# Altium project SixAxIMU_VN.PrjPcb
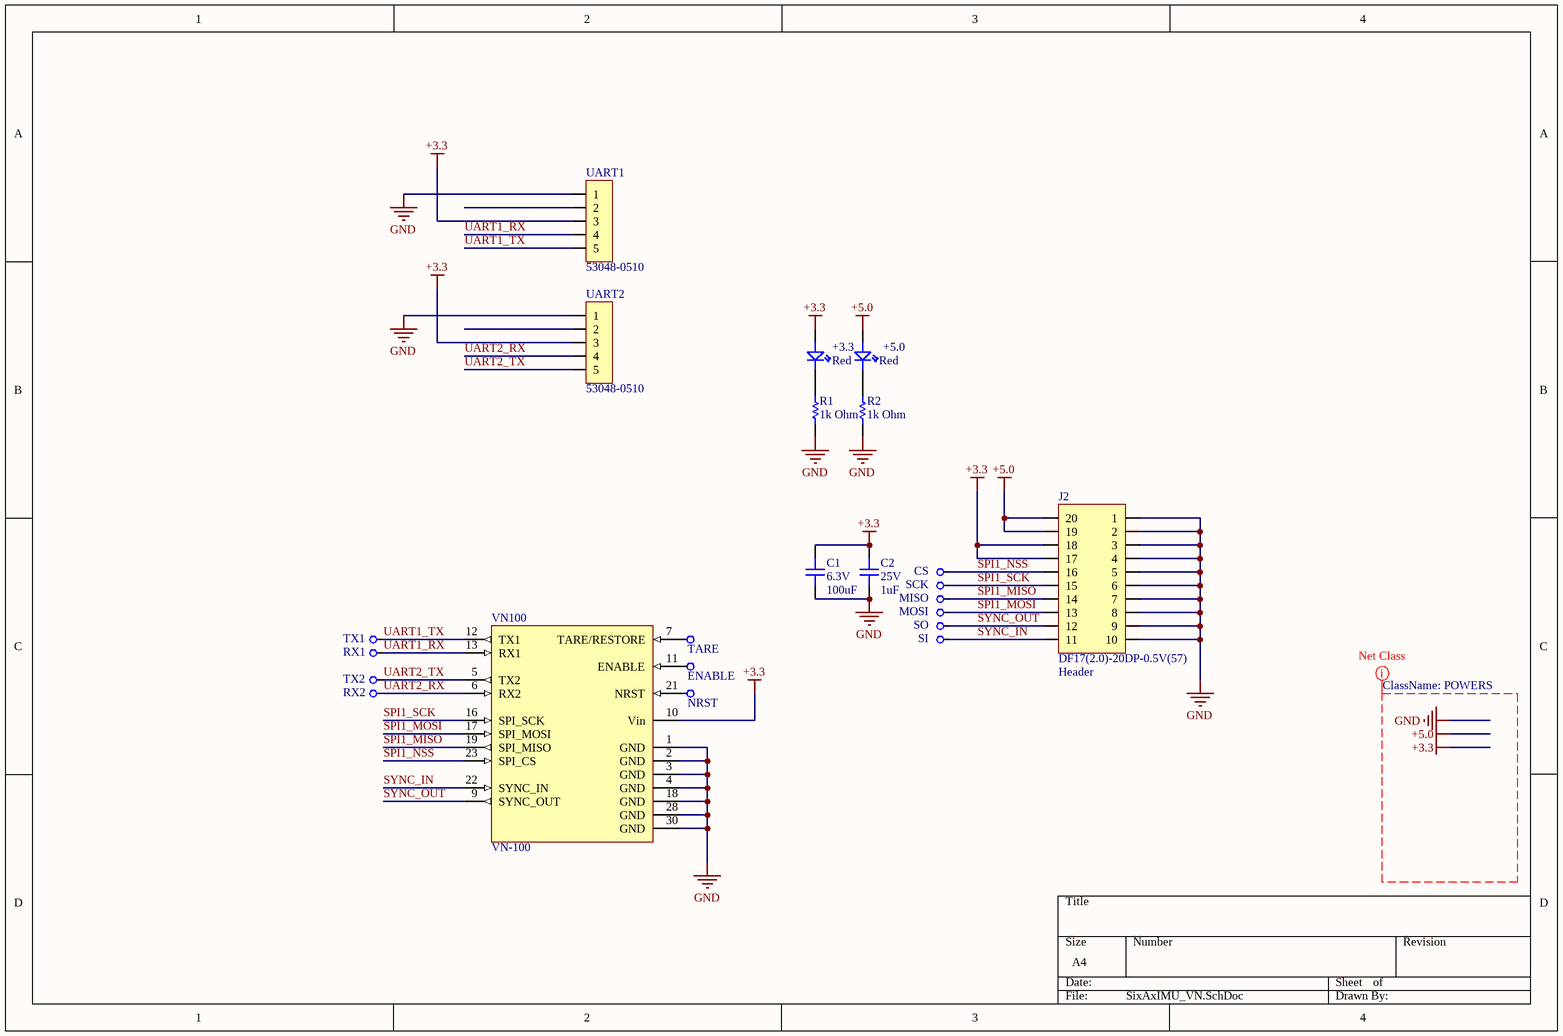
[diagram p0: SixAxIMU_VN.SchDoc]
1 sheet, 23 parts. Net scope: global (net labels, ports and power ports of the same name join across sheets).
Board file: SixAxIMU_VN.PcbDoc

## Sheet SixAxIMU_VN.SchDoc
size A4

### Parts
+3.3  Red  [LED 0603]
+5.0  Red  [LED 0603]
C1  value 100uF  Voltage Rating: 6.3V  [CAP 1206]  (hidden comment: CL31A107MQHNNNE)
C2  value 1uF  Voltage Rating: 25V  [CAP 0603]  (hidden comment: CL10A105KA8NNNC)
CS  TEST  [TEST_0.5mm, SMD]  (value not drawn)
ENABLE  TEST  [TEST_0.5mm, SMD]  (value not drawn)
J2  DF17(2.0)-20DP-0.5V(57)  Type: Header  [DF17(2.0)-20DP-0.5V(57)]
MISO  TEST  [TEST_0.5mm, SMD]  (value not drawn)
MOSI  TEST  [TEST_0.5mm, SMD]  (value not drawn)
NRST  TEST  [TEST_0.5mm, SMD]  (value not drawn)
R1  value 1k Ohm  [RES 0402]  (hidden comment: P311-1.00KLRTR-ND)
R2  value 1k Ohm  [RES 0402]  (hidden comment: P311-1.00KLRTR-ND)
RX1  TEST  [TEST_0.5mm, SMD]  (value not drawn)
RX2  TEST  [TEST_0.5mm, SMD]  (value not drawn)
SCK  TEST  [TEST_0.5mm, SMD]  (value not drawn)
SI  TEST  [TEST_0.5mm, SMD]  (value not drawn)
SO  TEST  [TEST_0.5mm, SMD]  (value not drawn)
TARE  TEST  [TEST_0.5mm, SMD]  (value not drawn)
TX1  TEST  [TEST_0.5mm, SMD]  (value not drawn)
TX2  TEST  [TEST_0.5mm, SMD]  (value not drawn)
UART1  53048-0510  [PicoBlade, 53048-0510]
UART2  53048-0510  [PicoBlade, 53048-0510]
VN100  VN-100  [VN-100]

### Nets
+3.3: +3.3.A C1.2 C2.2 J2.17 J2.18 UART1.3 UART2.3 VN100.10(Vin)
+5.0: +5.0.A J2.19 J2.20
GND: C1.1 C2.1 J2.1 J2.2 J2.3 J2.4 J2.5 J2.6 J2.7 J2.8 J2.9 J2.10 R1.1 R2.1 UART1.1 UART2.1 VN100.1(GND) VN100.2(GND) VN100.3(GND) VN100.4(GND) VN100.18(GND) VN100.28(GND) VN100.30(GND)
SPI1_MISO: J2.14 MISO.0 VN100.19(SPI_MISO)
SPI1_MOSI: J2.13 MOSI.0 VN100.17(SPI_MOSI)
SPI1_NSS: CS.0 J2.16 VN100.23(SPI_CS)
SPI1_SCK: J2.15 SCK.0 VN100.16(SPI_SCK)
SYNC_IN: J2.11 SI.0 VN100.22(SYNC_IN)
SYNC_OUT: J2.12 SO.0 VN100.9(SYNC_OUT)
UART1_RX: RX1.0 UART1.4 VN100.13(RX1)
UART1_TX: TX1.0 UART1.5 VN100.12(TX1)
UART2_RX: RX2.0 UART2.4 VN100.6(RX2)
UART2_TX: TX2.0 UART2.5 VN100.5(TX2)
Net+3.3_K: +3.3.K R1.2
Net+5.0_K: +5.0.K R2.2
NetENABLE_0: ENABLE.0 VN100.11(ENABLE)
NetNRST_0: NRST.0 VN100.21(NRST)
NetTARE_0: TARE.0 VN100.7(TARE/RESTORE)

Not connected (* = marked no-connect by the designer): UART1 2; UART2 2

### Layout directives
net class POWERS: +3.3, +5.0, GND

### Library data of the parts
+3.3 +5.0 = 1608SURC-06: LED, Red, 0603; Manufacturer Part Number: 1608SURC-06; ComponentLink1Description: Datasheet; Colour: Red
C1 = CL31A107MQHNNNE: MLCC, 100uF, 1206, 20%, 6.3V, X5R; Manufacturer: Samsung; Temp Range: -55-125°C; Manufacturer Part Number: CL31A107MQHNNNE; ComponentLink1Description: Datasheet; ComponentLink1URL: http://www.samsungsem.com/servlet/ProductSearchView?page=1&searchIdx=1&lang=kr&partnum=1&find_val=CL31A107MQHNNNE; Temp Coefficient: X5R; Tolerance: 20%
C2 = CL10A105KA8NNNC: MLCC, 1uF, 0603, 10%, 25V, X5R; Manufacturer: Samsung; Temp Range: -55-125°C; Manufacturer Part Number: CL10A105KA8NNNC; ComponentLink1Description: Datasheet; ComponentLink1URL: http://www.samsungsem.com/servlet/ProductSearchView?page=1&searchIdx=1&lang=kr&partnum=1&find_val=CL10A105KA8NNNC; Temp Coefficient: X5R; Tolerance: 10%
J2 = DF17(2.0)-20DP-0.5V(57): Conn, B2B, 20 Pos, HEADER; Manufacturer: Hirose; Manufacturer Part Number: DF17(2.0)-20DP-0.5V(57); ComponentLink1Description: Datasheet; ComponentLink1URL: http://www.mouser.com/ds/2/185/en_DF17_20130411-253728.pdf; Tolerance: *
R1 R2 = P311-1.00KLRTR-ND: RES, 0402, 1k, 1%; Manufacturer: Yageo; Power: 63mW; Manufacturer Part Number: P311-1.00KLRTR-ND; ComponentLink1Description: Datasheet; ComponentLink1URL: http://www.yageo.com/NewPortal/_en/search/productDocs.jsp?YageoPartNumber=P311-1.00KLRTR-ND; Tolerance: 1%
UART1 UART2 = 53048-0510: PicoBlade, Header, R/A, PTH, 5 Pos, 1.25mm Pitch; Manufacturer: Molex; Rows: 1; ComponentLink1Description: Datasheet; ComponentLink1URL: http://www.molex.com/molex/products/datasheet.jsp?part=active/0530480510_PCB_HEADERS.xml; ManufacturerPartNumber: 53048-0510; Pins: 5; Pitch: 1.25mm; Series: PicoBlade
VN100 = VN-100: Vector Nav SMD IMU/AHRS; Manufacturer: Vector Nav; Manufacturer Part Number: VN-100; ComponentLink1Description: Datasheet; ComponentLink1URL: http://www.vectornav.com/products/vn100-smd; Tolerance: *
CS ENABLE MISO MOSI NRST RX1 RX2 SCK SI SO TARE TX1 TX2 = TEST: ComponentLink1Description: Datasheet